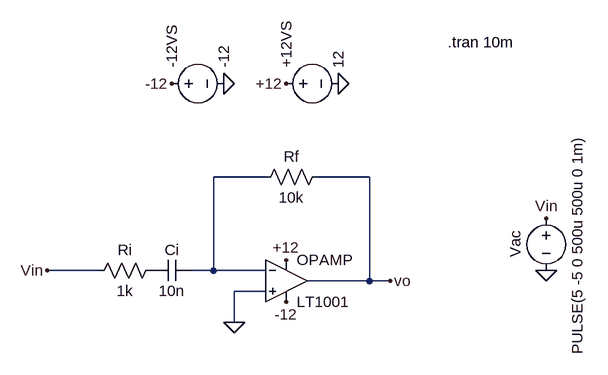
[diagram p0: schematic exp83.asc]
exp83.asc, the LTspice schematic file:
Version 4
SHEET 1 880 680
WIRE 240 -32 160 -32
WIRE 400 -32 320 -32
WIRE -16 112 -96 112
WIRE 160 112 160 -32
WIRE 160 112 128 112
WIRE 240 112 160 112
WIRE 400 128 400 -32
WIRE 400 128 304 128
WIRE 432 128 400 128
WIRE 240 144 192 144
WIRE 192 192 192 144
FLAG 272 -176 +12
FLAG 96 -176 -12
FLAG 176 -176 0
FLAG 352 -176 0
FLAG 272 160 -12
FLAG 272 96 +12
FLAG 432 128 vo
FLAG 672 112 0
FLAG 672 32 Vin
FLAG 192 192 0
FLAG -96 112 Vin
SYMBOL voltage 256 -176 R270
WINDOW 123 0 0 Left 0
WINDOW 39 0 0 Left 0
SYMATTR InstName +12VS
SYMATTR Value 12
SYMBOL voltage 80 -176 R270
WINDOW 123 0 0 Left 0
WINDOW 39 0 0 Left 0
SYMATTR InstName -12VS
SYMATTR Value -12
SYMBOL OpAmps\\LT1001 272 64 R0
SYMATTR InstName OPAMP
SYMBOL voltage 672 16 R0
WINDOW 0 -32 56 VBottom 2
WINDOW 3 32 56 VTop 2
WINDOW 123 0 0 Left 0
WINDOW 39 0 0 Left 0
SYMATTR InstName Vac
SYMATTR Value PULSE(5 -5 0 500u 500u 0 1m)
SYMBOL res 336 -48 R90
WINDOW 0 0 56 VBottom 2
WINDOW 3 32 56 VTop 2
SYMATTR InstName Rf
SYMATTR Value 10k
SYMBOL res 80 96 R90
WINDOW 0 0 56 VBottom 2
WINDOW 3 32 56 VTop 2
SYMATTR InstName Ri
SYMATTR Value 1k
SYMBOL cap 128 96 R90
WINDOW 0 0 32 VBottom 2
WINDOW 3 32 32 VTop 2
SYMATTR InstName Ci
SYMATTR Value 10n
TEXT 520 -240 Left 2 !.tran 10m

The netlist it stands for:
* exp83.asc
V§+12VS +12 0 12
V§-12VS -12 0 -12
XOPAMP 0 N001 +12 -12 vo LT1001  ; pins In+ In- V+ V- OUT
Vac Vin 0 PULSE(5 -5 0 500u 500u 0 1m)
Rf vo N001 10k
Ri P001 Vin 1k
Ci N001 P001 10n
.tran 10m
.lib LTC.lib
.backanno
.end

* Results of the author's LTspice run, read from the files saved beside the schematic
* Operating Point, zero values left out:
*   V(+12) = 12 V
*   V(-12) = -12 V
*   V(vin) = 5 V
*   V(p001) = 5 V
*   I(-12vs) = 2.25 mA
*   I(+12vs) = -2.25 mA
*   Ix(opamp:3) = 2.25 mA
*   Ix(opamp:4) = -2.25 mA
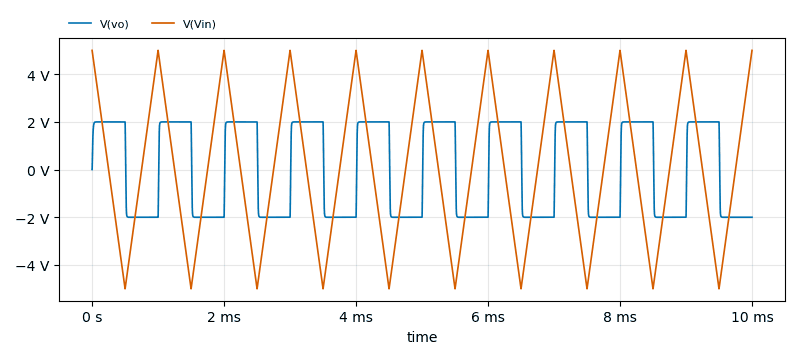
[diagram p1: Transient Analysis of exp83.asc, plotted from the saved traces]
* Transient Analysis, 1 run:
*   V(vo): min -2 V, max 2 V, average 2.059 mV, rms 1.972 V, last -2 V
*   V(Vin): min -5 V, max 5 V, average 0 V, rms 3.974 V, last 5 V